# EAGLE design STM32 RX (EAGLE 9.5.0)
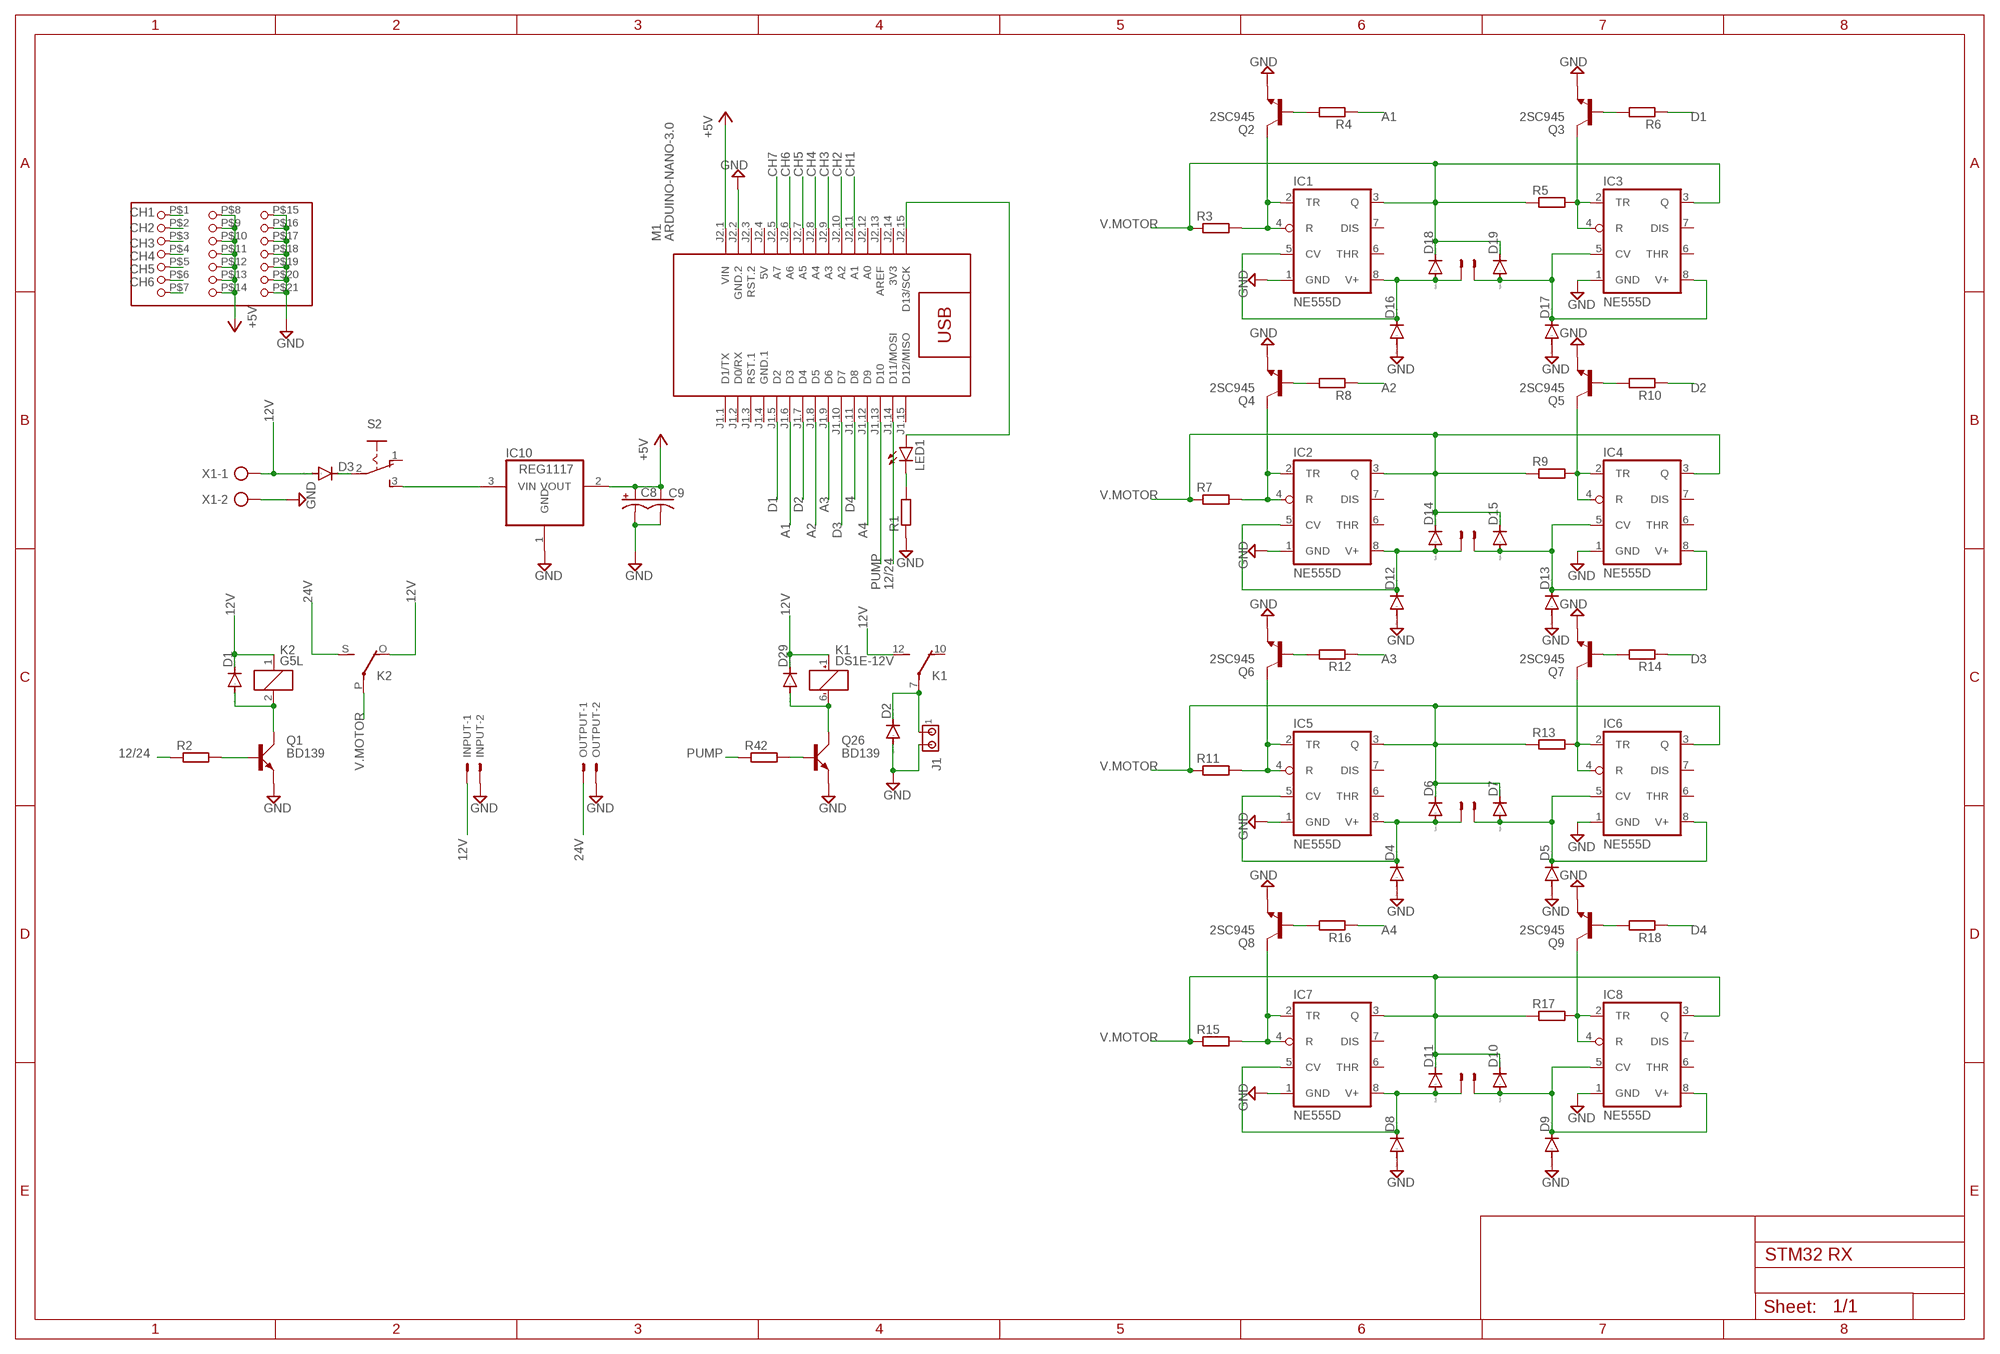
[diagram p0: schematic, sheet 1]

## Parts
C8  CPOL-USE2.5-6  [E2,5-6]
C9  C-US050-025X075  [C050-025X075]
D1  1N4933  [DO41-10]
D2  1N4933  [DO41-10]
D3  1N4933  [DO41-10]
D4  1N4933  [DO41-10]
D5  1N4933  [DO41-10]
D6  1N4933  [DO41-10]
D7  1N4933  [DO41-10]
D8  1N4933  [DO41-10]
D9  1N4933  [DO41-10]
D10  1N4933  [DO41-10]
D11  1N4933  [DO41-10]
D12  1N4933  [DO41-10]
D13  1N4933  [DO41-10]
D14  1N4933  [DO41-10]
D15  1N4933  [DO41-10]
D16  1N4933  [DO41-10]
D17  1N4933  [DO41-10]
D18  1N4933  [DO41-10]
D19  1N4933  [DO41-10]
D29  1N4933  [DO41-10]
IC1  NE555D  [SO08]
IC2  NE555D  [SO08]
IC3  NE555D  [SO08]
IC4  NE555D  [SO08]
IC5  NE555D  [SO08]
IC6  NE555D  [SO08]
IC7  NE555D  [SO08]
IC8  NE555D  [SO08]
IC10  REG1117  [SOT223]
INPUT  22-23-2021  [22-23-2021]
J1  MTA02-156  [1X2MTA]
K1  DS1E-12V  [DS1E]
K2  G5L  [G5LE]
LED1  LED5MM  [LED5MM]
M1  ARDUINO-NANO-3.0  [ARDUINO-NANO-3.0]
OUTPUT  22-23-2021  [22-23-2021]
OUTPUT1  22-23-2021  [22-23-2021]
OUTPUT2  22-23-2021  [22-23-2021]
OUTPUT3  22-23-2021  [22-23-2021]
OUTPUT4  22-23-2021  [22-23-2021]
Q1  BD139  [TO126AV]
Q2  2SC945  [TO92-ECB]
Q3  2SC945  [TO92-ECB]
Q4  2SC945  [TO92-ECB]
Q5  2SC945  [TO92-ECB]
Q6  2SC945  [TO92-ECB]
Q7  2SC945  [TO92-ECB]
Q8  2SC945  [TO92-ECB]
Q9  2SC945  [TO92-ECB]
Q26  BD139  [TO126AV]
R1  R-EU_0207/10  [0207/10]
R2  R-EU_0207/10  [0207/10]
R3  R-EU_0207/10  [0207/10]
R4  R-EU_0207/10  [0207/10]
R5  R-EU_0207/10  [0207/10]
R6  R-EU_0207/10  [0207/10]
R7  R-EU_0207/10  [0207/10]
R8  R-EU_0207/10  [0207/10]
R9  R-EU_0207/10  [0207/10]
R10  R-EU_0207/10  [0207/10]
R11  R-EU_0207/10  [0207/10]
R12  R-EU_0207/10  [0207/10]
R13  R-EU_0207/10  [0207/10]
R14  R-EU_0207/10  [0207/10]
R15  R-EU_0207/10  [0207/10]
R16  R-EU_0207/10  [0207/10]
R17  R-EU_0207/10  [0207/10]
R18  R-EU_0207/10  [0207/10]
R42  R-EU_0207/10  [0207/10]
S2  255SB  [255SB]
U$1  PINHEAD3  [PINHEAD3]
X1  AK500/2  [AK500/2]

## Nets
12/24: M1.J1.14(D11/MOSI) R2.1
12V: D1.C D3.A D29.C INPUT.1 K1.1(1:+) K1.12(2:S) K2.1 K2.O(2:O) X1.1
24V: K2.S(2:S) OUTPUT.1
+5V: C8.+ C9.1 IC10.2(VOUT) M1.J2.1(VIN) U$1.P$8 U$1.P$9 U$1.P$10 U$1.P$11 U$1.P$12 U$1.P$13 U$1.P$14
A1: M1.J1.6(D3) R4.1
A2: M1.J1.8(D5) R8.1
A3: M1.J1.9(D6) R12.1
A4: M1.J1.12(D9) R16.1
CH1: M1.J2.11(A1) U$1.P$1
CH2: M1.J2.10(A2) U$1.P$2
CH3: M1.J2.9(A3) U$1.P$3
CH4: M1.J2.8(A4) U$1.P$4
CH5: M1.J2.7(A5) U$1.P$5
CH6: M1.J2.6(A6) U$1.P$6
CH7: M1.J2.5(A7)
D1: M1.J1.5(D2) R6.1
D2: M1.J1.7(D4) R10.1
D3: M1.J1.10(D7) R14.1
D4: M1.J1.11(D8) R18.1
GND: C8.- C9.2 D2.A D4.A D5.A D8.A D9.A D12.A D13.A D16.A D17.A IC1.1(GND) IC2.1(GND) IC3.1(GND) IC4.1(GND) IC5.1(GND) IC6.1(GND) IC7.1(GND) IC8.1(GND) IC10.1(GND) INPUT.2 J1.2 M1.J2.2(GND.2) OUTPUT.2 Q1.E Q2.E Q3.E Q4.E Q5.E Q6.E Q7.E Q8.E Q9.E Q26.E R1.1 U$1.P$15 U$1.P$16 U$1.P$17 U$1.P$18 U$1.P$19 U$1.P$20 U$1.P$21 X1.2
N$1: LED1.A M1.J2.15(D13/SCK)
N$2: D1.A K2.2 Q1.C
N$3: LED1.K(C) R1.2
N$4: Q1.B R2.2
N$5: D3.C S2.2(P)
N$6: IC10.3(VIN) S2.3(S)
N$13: IC1.2(TR) IC1.4(R) Q2.C R3.2
N$14: D16.C D18.A IC1.5(CV) IC1.8(V+) OUTPUT1.1
N$15: IC2.2(TR) IC2.4(R) Q4.C R7.2
N$16: Q2.B R4.2
N$17: IC3.2(TR) IC3.4(R) Q3.C R5.2
N$18: D17.C D19.A IC3.5(CV) IC3.8(V+) OUTPUT1.2
N$19: Q3.B R6.2
N$20: D12.C D14.A IC2.5(CV) IC2.8(V+) OUTPUT2.1
N$21: Q4.B R8.2
N$22: IC4.2(TR) IC4.4(R) Q5.C R9.2
N$23: D13.C D15.A IC4.5(CV) IC4.8(V+) OUTPUT2.2
N$24: Q5.B R10.2
N$25: IC5.2(TR) IC5.4(R) Q6.C R11.2
N$26: D4.C D6.A IC5.5(CV) IC5.8(V+) OUTPUT3.1
N$27: Q6.B R12.2
N$28: IC6.2(TR) IC6.4(R) Q7.C R13.2
N$29: D5.C D7.A IC6.5(CV) IC6.8(V+) OUTPUT3.2
N$30: Q7.B R14.2
N$31: IC7.2(TR) IC7.4(R) Q8.C R15.2
N$32: D8.C D11.A IC7.5(CV) IC7.8(V+) OUTPUT4.1
N$33: Q8.B R16.2
N$34: IC8.2(TR) IC8.4(R) Q9.C R17.2
N$35: D9.C D10.A IC8.5(CV) IC8.8(V+) OUTPUT4.2
N$36: Q9.B R18.2
N$38: U$1.P$7
N$62: D2.C J1.1 K1.7(2:P)
N$63: D29.A K1.6(1:-) Q26.C
N$64: Q26.B R42.2
PUMP: M1.J1.13(D10) R42.1
V.MOTOR: D6.C D7.C D10.C D11.C D14.C D15.C D18.C D19.C IC1.3(Q) IC2.3(Q) IC3.3(Q) IC4.3(Q) IC5.3(Q) IC6.3(Q) IC7.3(Q) IC8.3(Q) K2.P(2:P) R3.1 R5.1 R7.1 R9.1 R11.1 R13.1 R15.1 R17.1
Unconnected: IC1.6(THR) IC1.7(DIS) IC2.6(THR) IC2.7(DIS) IC3.6(THR) IC3.7(DIS) IC4.6(THR) IC4.7(DIS) IC5.6(THR) IC5.7(DIS) IC6.6(THR) IC6.7(DIS) IC7.6(THR) IC7.7(DIS) IC8.6(THR) IC8.7(DIS) K1.10(2:O) M1.J1.1(D1/TX) M1.J1.2(D0/RX) M1.J1.3(RST.1) M1.J1.15(D12/MISO) M1.J2.3(RST.2) M1.J2.12(A0) M1.J2.13(AREF) S2.1(O)

## Power pins joined to a net without a drawn wire
3V3: M1.J2.14(3V3)
5V: M1.J2.4(5V)
GND.1: M1.J1.4(GND.1)

## Library data of the parts
C8 = rcl:CPOL-US: POLARIZED CAPACITOR, American symbol; SPICEPREFIX: C
C9 = rcl:C-US: CAPACITOR, American symbol; SPICEPREFIX: C
D1-D19 D29 = diode:1N4933: DIODE fast recovery rectifier, 1A
IC1-IC8 = linear:*555: TIMER
IC10 = burr-brown:REG1117: 800mA and 1A Low Dropout (LDO) Positive Regulator 1.8V, 2.5V, 2.85V, 3.3V, 5V, and Adj; MPN: REG1117; OC_FARNELL: 1097566; OC_NEWARK: 14P6981
INPUT OUTPUT OUTPUT1-OUTPUT4 = con-molex:22-23-2021: .100" (2.54mm) Center Header - 2 Pin; MF: MOLEX; MPN: 22-23-2021; OC_FARNELL: 1462926; OC_NEWARK: 25C3832
J1 = con-amp:MTA02-156: AMP connector
K1 = relay:DS1E-*?: DS-RELAYS HIGHLY SENSITIVE 1500 V FCC SURGE NAiS WITHSTANDING MINIATURE RELAY Source: http://www.mew-europe.com/.. en_ds_61005_0001.pdf; OC_FARNELL: unknown; OC_NEWARK: unknown
K2 = relay:G5L: RELAY 1 x switch, 10 A/120 V AC, 8 A/30 V ADC, Omron; OC_FARNELL: unknown; OC_NEWARK: unknown
LED1 = led:LED: LED OSRAM: - CHIPLED LG R971, LG N971, LY N971, LG Q971, LY Q971, LO R971, LY R971 LH N974, LH R974 LS Q976, LO Q976, LY Q976 LO Q996 - Hyper CHIPLED LW Q18S LB Q993, LB Q99A, LB R99A - SideLED LS A670, LO A670, LY A670, LG A670, LP A670 LB A673, LV A673, LT A673, LW A673 LH A674 LY A675 LS A676, LA A676, LO A676, LY A676, LW A676 LS A679, LY A679, LG A679 - Hyper Micro SIDELED® LS Y876, LA Y876, LO Y876, LY Y876 LT Y87S - SmartLED LW L88C, LW L88S LB L89C, LB L89S, LG L890 LS L89K, LO L89K, LY L89K LS L896, LA L896, LO L896, LY L896 - TOPLED LS T670, LO T670, LY T670, LG T670, LP T670 LSG T670, LSP T670, LSY T670, LOP T670, LYG T670 LG T671, LOG T671, LSG T671 LB T673, LV T673, LT T673, LW T673 LH T674 LS T676, LA T676, LO T676, LY T676, LB T676, LH T676, LSB T676, LW T676 LB T67C, LV T67C, LT T67C, LS T67K, LO T67K, LY T67K, LW E67C LS E67B, LA E67B, LO E67B, LY E67B, LB E67C, LV E67C, LT E67C LW T67C LS T679, LY T679, LG T679 LS T770, LO T770, LY T770, LG T770, LP T770 LB T773, LV T773, LT T773, LW T773 LH T774 LS E675, LA E675, LY E675, LS T675 LS T776, LA T776, LO T776, LY T776, LB T776 LHGB T686 LT T68C, LB T68C - Hyper Mini TOPLED® LB M676 - Mini TOPLED Santana® LG M470 LS M47K, LO M47K, LY M47K Source: http://www.osram.convergy.de LUXEON: - LUMILED® LXK2-PW12-R00, LXK2-PW12-S00, LXK2-PW14-U00, LXK2-PW14-V00 LXK2-PM12-R00, LXK2-PM12-S00, LXK2-PM14-U00 LXK2-PE12-Q00, LXK2-PE12-R00, LXK2-PE12-S00, LXK2-PE14-T00, LXK2-PE14-U00 LXK2-PB12-K00, LXK2-PB12-L00, LXK2-PB12-M00, LXK2-PB14-N00, LXK2-PB14-P00, LXK2-PB14-Q00 LXK2-PR12-L00, LXK2-PR12-M00, LXK2-PR14-Q00, LXK2-PR14-R00 LXK2-PD12-Q00, LXK2-PD12-R00, LXK2-PD12-S00 LXK2-PH12-R00, LXK2-PH12-S00 LXK2-PL12-P00, LXK2-PL12-Q00, LXK2-PL12-R00 Source: www.luxeon.com KINGBRIGHT: KA-3528ASYC Source: www.kingbright.com
M1 = diy-modules:ARDUINO-NANO-3.0: Arduino Nano 3.0 and compatible devices More details available here: https://www.arduino.cc/en/Main/ArduinoBoardNano Click here to find device on ebay.com <http://www.ebay.com/sch/arduino+nano>
Q1 Q26 = transistor-power:BD139: NPN TRANSISTOR
Q2-Q9 = transistor:2SC945: NPN Silicon Epitaxial Planar Transistor Source: SEMTECH ELECTRONICS LTD. ... 2SC945 2.pdf
R1-R18 R42 = rcl:R-EU_: RESISTOR, European symbol; SPICEPREFIX: R
S2 = switch:255SB: SLIDING SWITCH Distributor Buerklin, 11G810
U$1 = pinhead3:PINHEAD3
X1 = con-ptr500:AK500/2: CONNECTOR; OC_FARNELL: unknown; OC_NEWARK: unknown

## Board
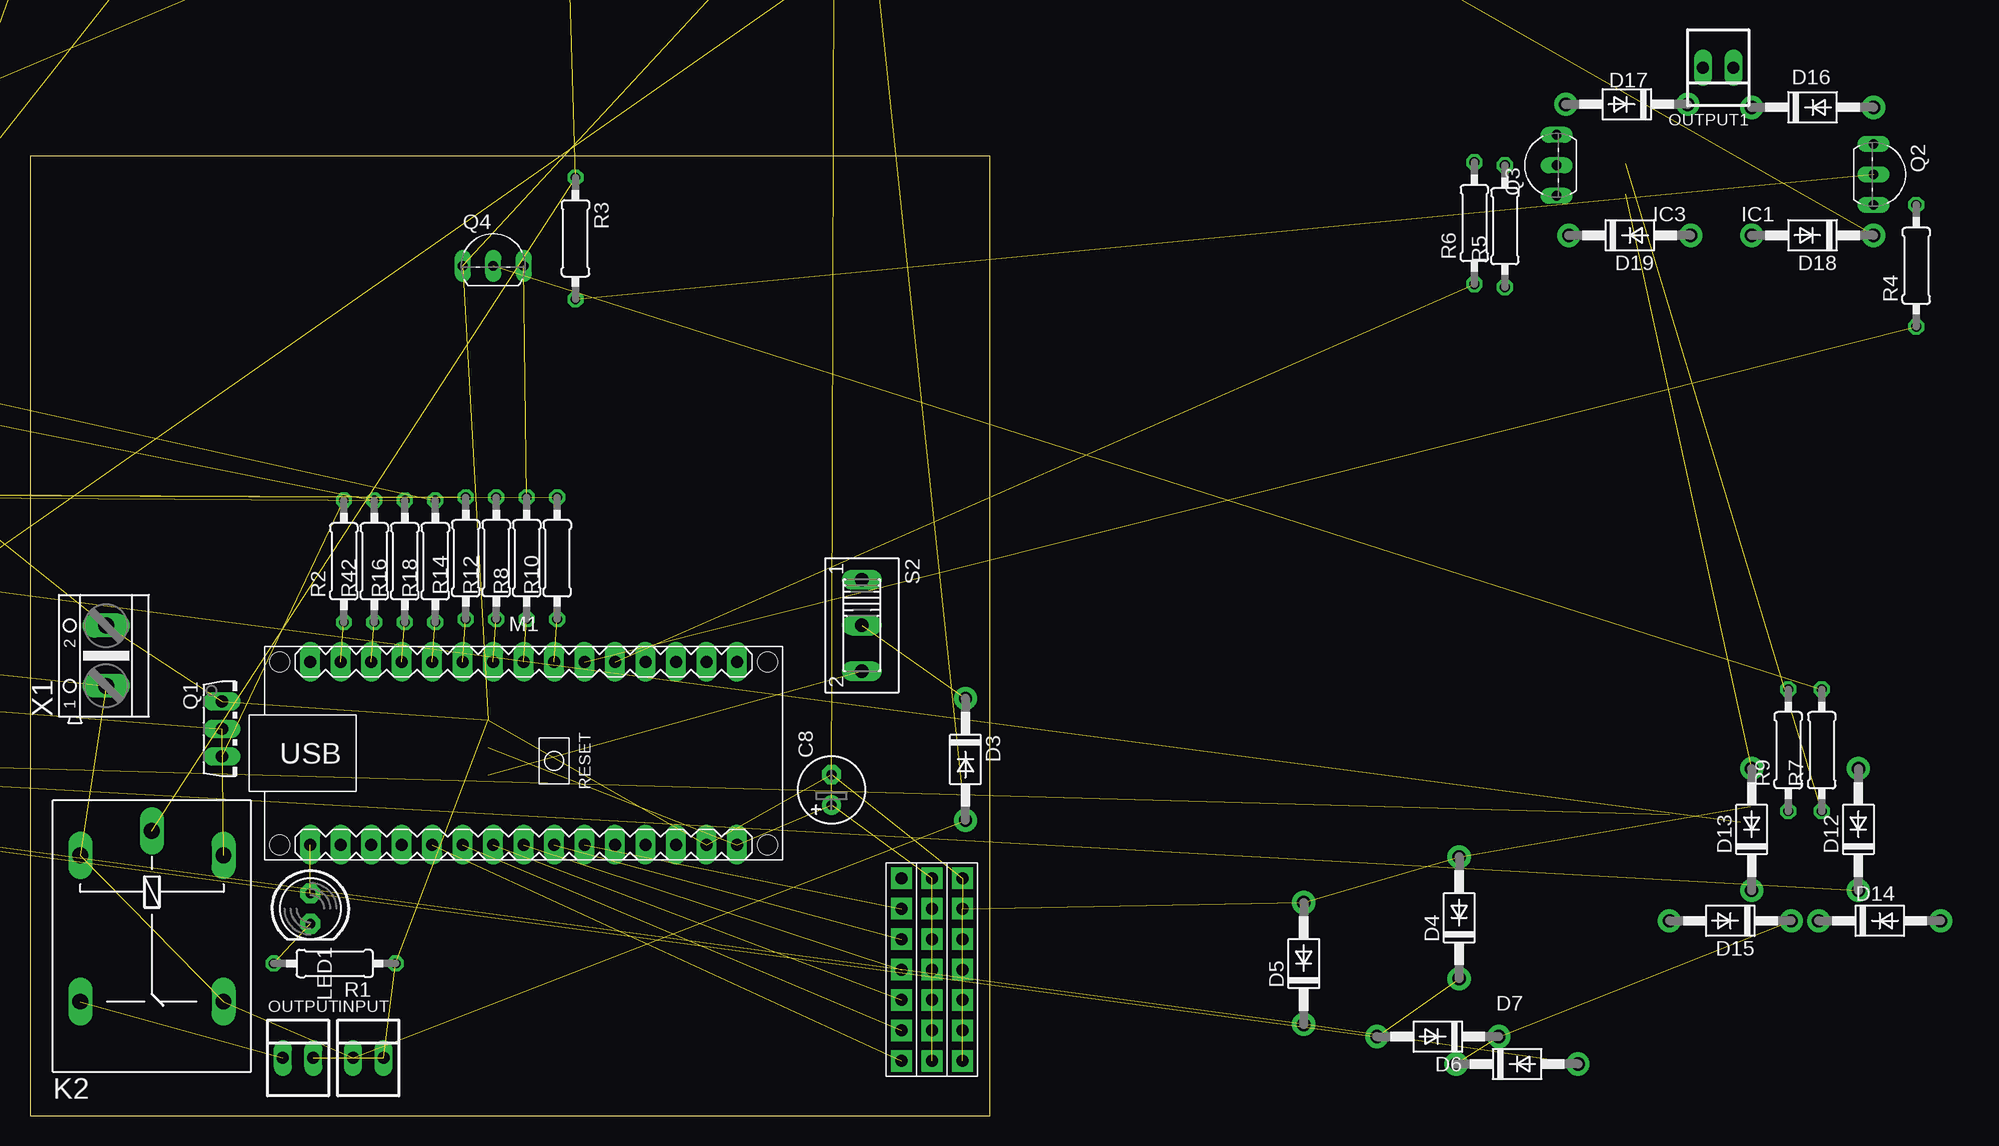
[diagram p1: board, top side]
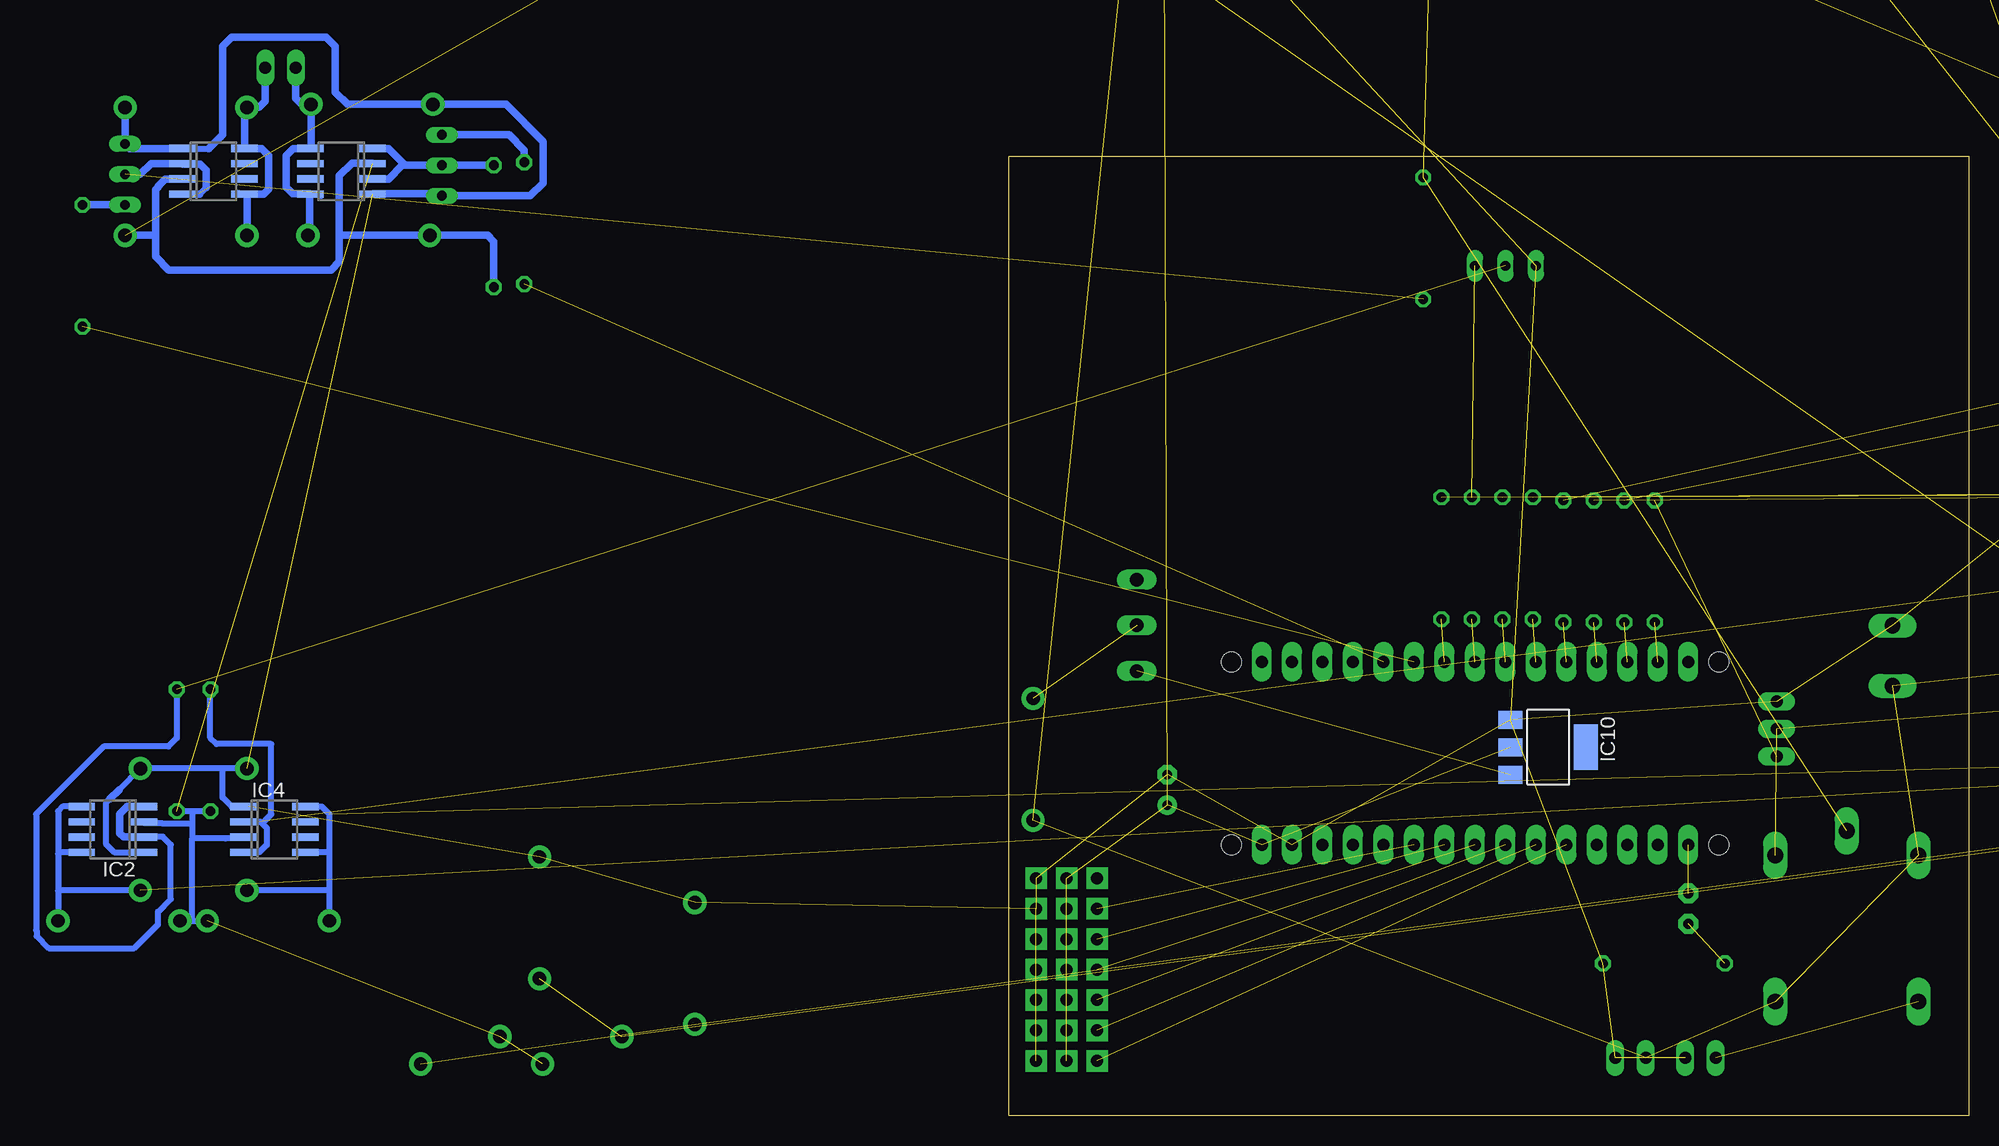
[diagram p2: board, bottom side, seen from below]

Size 80 x 80 mm. Coordinates in mm from the lower left corner, seen from the top.
Outline: 0,0 80,0 80,80 0,80 0,0
Copper layers (1*16): Top 0.035mm / dielectric 1.5mm / Bottom 0.035mm
Design rules "default": minimum track width 6mil, minimum drill 0.35mm, track to track 24mil, track to pad 24mil, pad to pad 24mil, via to via 24mil, smd to smd 24mil, copper to edge 40mil, drill to drill 6mil, minimum pad ring 10mil, minimum via ring 8mil, stop-mask expansion 4mil, vias tented up to drill 0mil, thermal gap 10mil

### Footprints (pad centres in the part's own frame; a part is rotated, then mirrored left to right if it is on the bottom)
E2,5-6 = drill 0.813 pad 1.6: + -1.27,0 | drill 0.813 pad 1.6 octagon: - 1.27,0
C050-025X075 = drill 0.813 pad 1.93 octagon: 1 -2.54,0; 2 2.54,0
DO41-10 = drill 1.118 pad 1.93: A 5.08,0; C -5.08,0
SO08 = smd 0.6 x 2.2: 1 -1.905,-2.6; 2 -0.635,-2.6; 3 0.635,-2.6; 4 1.905,-2.6; 5 1.905,2.6; 6 0.635,2.6; 7 -0.635,2.6; 8 -1.905,2.6
SOT223 = smd 1.499 x 2.007: 1 -2.261,-3.15; 2 0.025,-3.15; 3 2.311,-3.15 | smd 3.81 x 2.007: 4 0,3.15
22-23-2021 = drill 1 long: 1 -1.27,0; 2 1.27,0
1X2MTA = drill 1.676 long: 1 1.981,0; 2 -1.981,0
DS1E = drill 0.9: 1 -6.35,-3.81; 6 6.35,-3.81; 7 6.35,3.81; 10 -1.27,3.81; 12 -6.35,3.81
G5LE = drill 1.321 long: 1 -7.493,-5.969; 2 -7.493,5.969; O 4.699,5.969; P -9.525,0; S 4.699,-5.969
LED5MM = drill 0.813 pad 1.676 octagon: A -1.27,0; K 1.27,0
ARDUINO-NANO-3.0 = drill 1 pad 1.676 long: J1.1 17.78,7.62; J1.2 15.24,7.62; J1.3 12.7,7.62; J1.4 10.16,7.62; J1.5 7.62,7.62; J1.6 5.08,7.62; J1.7 2.54,7.62; J1.8 0,7.62; J1.9 -2.54,7.62; J1.10 -5.08,7.62; J1.11 -7.62,7.62; J1.12 -10.16,7.62; J1.13 -12.7,7.62; J1.14 -15.24,7.62; J1.15 -17.78,7.62; J2.1 17.78,-7.62; J2.2 15.24,-7.62; J2.3 12.7,-7.62; J2.4 10.16,-7.62; J2.5 7.62,-7.62; J2.6 5.08,-7.62; J2.7 2.54,-7.62; J2.8 0,-7.62; J2.9 -2.54,-7.62; J2.10 -5.08,-7.62; J2.11 -7.62,-7.62; J2.12 -10.16,-7.62; J2.13 -12.7,-7.62; J2.14 -15.24,-7.62; J2.15 -17.78,-7.62 | hole 1.651: -20.32,7.62; -20.32,-7.62; 20.32,-7.62; 20.32,7.62
TO126AV = drill 1.016 long: B 2.286,-1.27; C 0,-1.27; E -2.286,-1.27
TO92-ECB = drill 0.813 long: B 2.54,0; C 0,0; E -2.54,0
0207/10 = drill 0.813 octagon: 1 -5.08,0; 2 5.08,0
255SB = drill 1.118 long: 1 -3.81,0; 2 0,0; 3 3.81,0
PINHEAD3 = drill 1 pad 1.778 square: P$1 -7.62,2.54; P$2 -5.08,2.54; P$3 -2.54,2.54; P$4 0,2.54; P$5 2.54,2.54; P$6 5.08,2.54; P$7 7.62,2.54; P$8 -7.62,0; P$9 -5.08,0; P$10 -2.54,0; P$11 0,0; P$12 2.54,0; P$13 5.08,0; P$14 7.62,0; P$15 -7.62,-2.54; P$16 -5.08,-2.54; P$17 -2.54,-2.54; P$18 0,-2.54; P$19 2.54,-2.54; P$20 5.08,-2.54; P$21 7.62,-2.54
AK500/2 = drill 1.321 long: 1 -2.515,0; 2 2.515,0

### Placement (x,y rotation side)
C8  66.8,27.18 90 top
C9  69.6,109.98 0 top  (outside the outline)
D1  -32.77,41.15 270 top  (outside the outline)
D2  -22.35,50.04 180 top  (outside the outline)
D3  77.98,29.72 270 top
D4  119.13,16.51 90 top  (outside the outline)
D5  106.17,12.7 90 top  (outside the outline)
D6  117.35,6.6 180 top  (outside the outline)
D7  123.95,4.32 0 top  (outside the outline)
D8  -57.15,71.12 0 top  (outside the outline)
D9  -69.85,71.12 0 top  (outside the outline)
D10  -82.55,71.12 0 top  (outside the outline)
D11  -95.25,71.12 0 top  (outside the outline)
D12  152.4,23.88 90 top  (outside the outline)
D13  143.51,23.88 90 top  (outside the outline)
D14  154.18,16.26 0 top  (outside the outline)
D15  141.73,16.26 180 top  (outside the outline)
D16  148.59,84.07 0 top  (outside the outline)
D17  133.1,84.33 180 top  (outside the outline)
D18  148.59,73.41 180 top  (outside the outline)
D19  133.35,73.41 0 top  (outside the outline)
D29  74.68,104.9 0 top  (outside the outline)
IC1  146.3,78.74 270 bottom  (outside the outline)
IC2  154.69,23.88 90 bottom  (outside the outline)
IC3  135.64,78.74 90 bottom  (outside the outline)
IC4  141.22,23.88 270 bottom  (outside the outline)
IC5  -148.08,49.53 0 bottom  (outside the outline)
IC6  -160.27,-6.1 0 bottom  (outside the outline)
IC7  -141.48,50.55 0 bottom  (outside the outline)
IC8  -148.84,-6.1 0 bottom  (outside the outline)
IC10  35.05,30.73 270 bottom
INPUT  28.19,4.83 0 top
J1  11.68,136.14 0 top  (outside the outline)
K1  -20.32,43.18 0 top  (outside the outline)
K2  10.16,14.22 270 top
LED1  23.37,17.27 270 top
M1  41.15,30.23 0 top
OUTPUT  22.35,4.83 0 top
OUTPUT1  140.72,87.38 180 top  (outside the outline)
OUTPUT2  -54.61,30.48 0 top  (outside the outline)
OUTPUT3  -63.5,30.48 0 top  (outside the outline)
OUTPUT4  -72.39,30.48 0 top  (outside the outline)
Q1  17.27,32.26 270 top
Q2  153.67,78.49 270 top  (outside the outline)
Q3  127.25,79.25 90 top  (outside the outline)
Q4  38.61,70.87 0 top
Q5  -66.04,52.07 0 top  (outside the outline)
Q6  -74.93,52.07 0 top  (outside the outline)
Q7  -83.82,52.07 0 top  (outside the outline)
Q8  -92.71,52.07 0 top  (outside the outline)
Q9  -17.78,62.23 0 top  (outside the outline)
Q26  -34.29,64.77 0 top  (outside the outline)
R1  25.4,12.7 180 top
R2  26.16,46.23 90 top
R3  45.47,73.15 270 top
R4  157.23,70.87 90 top  (outside the outline)
R5  122.94,74.17 90 top  (outside the outline)
R6  120.4,74.42 90 top  (outside the outline)
R7  149.35,30.48 90 top  (outside the outline)
R8  41.4,46.48 90 top
R9  146.56,30.48 90 top  (outside the outline)
R10  43.94,46.48 90 top
R11  11.18,116.33 0 top  (outside the outline)
R12  38.86,46.48 90 top
R13  74.68,121.41 0 top  (outside the outline)
R14  36.32,46.48 90 top
R15  49.28,121.41 0 top  (outside the outline)
R16  31.24,46.23 90 top
R17  23.88,121.41 0 top  (outside the outline)
R18  33.78,46.23 90 top
R42  28.7,46.23 90 top
S2  69.34,40.89 270 top
U$1  75.18,12.19 90 top
X1  6.35,38.35 90 top

### Tracks (layer width: path | path; a pad name or v marks a point on that pad's centre or on a via)
12/24  (1 unrouted)
12V  (8 unrouted)
24V  (1 unrouted)
+5V  (10 unrouted)
A1  (1 unrouted)
A2  (1 unrouted)
A3  (1 unrouted)
A4  (1 unrouted)
CH1  (1 unrouted)
CH2  (1 unrouted)
CH3  (1 unrouted)
CH4  (1 unrouted)
CH5  (1 unrouted)
CH6  (1 unrouted)
D1  (1 unrouted)
D2  (1 unrouted)
D3  (1 unrouted)
D4  (1 unrouted)
GND  (34 unrouted)
  Bottom 0.254: 130.56,84.33 128.52,84.33
  Bottom 0.508: IC1.1 146.69,80.64 | IC2.1 154.56,21.97 155.27,22.68 155.27,26.09 154.94,26.42 | 143.38,25.78 IC4.1 144.78,25.78 145.54,26.54 145.54,28.96 | D13.A 145.54,28.96 | 145.54,28.96 D12.A 154.18,27.18
  Bottom 0.61: IC1.1 153.29,80.64 Q2.E D16.A | IC3.1 132.98,76.89 127.44,76.89 Q3.E 119.89,76.71 118.82,77.78 118.82,81.23 121.92,84.33 D17.A 128.52,84.33 135.13,84.33 136.14,85.34 136.14,89.15 136.91,89.92 144.78,89.92 145.54,89.15 145.54,81.79 146.69,80.64 | IC4.1 144.4,25.78 | 154.18,27.18 154.94,26.42
N$1  (1 unrouted)
N$2  (2 unrouted)
N$3  (1 unrouted)
N$4  (1 unrouted)
N$5  (1 unrouted)
N$6  (1 unrouted)
N$13  (1 unrouted)
  Bottom 0.508: 146.89,77.39 147.45,76.83
  Bottom 0.61: Q2.C 152.4,78.49 151.51,79.38 IC1.2 148.85,79.32 148.4,79.32 148.39,79.32 147.39,79.32 146.89,78.82 146.89,77.39 | 147.45,76.83 IC1.4
N$14
  Bottom 0.61: IC1.5 142.11,76.83 141.69,77.26 141.69,80.05 142.28,80.64 IC1.8 143.7,83.88 D16.C 142.49,84.07 141.99,84.58 OUTPUT1.1 | IC1.5 144.15,76.83 144.2,76.89 | 144.27,76.89 144.22,76.83 IC1.5 | D18.A 143.51,76.64 IC1.5
N$15  (1 unrouted)
  Bottom 0.508: R7.2 149.35,31.5 150.06,30.79 155.45,30.79 161.09,25.15 161.09,15.5 161.04,15.45 161.04,14.99 160.02,13.97 152.91,13.97 150.93,15.95 150.93,17.01 149.86,18.08 149.86,22.61 150.52,23.27 151.07,23.27 151.1,23.29 151.54,23.29 151.55,23.29 152.04,23.29 IC2.2
  Bottom 0.61: IC2.4 153.51,25.78 154.1,25.19 154.1,23.54 153.8,23.24 IC2.2
N$16
  Bottom 0.61: R4.2 Q2.B
N$17
  Bottom 0.61: IC3.4 131.7,80.64 130.43,79.38 130.56,79.25 | 130.56,79.25 Q3.C R5.2 | IC3.2 131.7,78.11 130.56,79.25
N$18
  Bottom 0.61: 137.41,76.71 137.54,76.83 IC3.8 138.29,76.89 | 138.29,76.89 139.72,76.89 140.25,77.43 140.25,80.05 139.66,80.64 IC3.5 138.18,80.7 D17.C 138.94,84.33 139.45,84.84 OUTPUT1.2 | D19.A 138.29,73.54 138.29,76.89
N$19
  Bottom 0.61: Q3.B 121.67,81.79 120.4,80.52 R6.2
N$20  (1 unrouted)
  Bottom 0.508: IC2.5 158.88,25.78 159.26,25.4 159.26,21.84 | 159.26,21.84 159.26,18.8 | 159.26,18.8 D14.A | IC2.8 159.13,21.97 159.26,21.84 | D12.C 159.26,18.8
N$21  (1 unrouted)
N$22  (1 unrouted)
  Bottom 0.508: IC4.4 142.47,21.97 141.86,22.58 141.86,24 142.24,24.38 | 142.24,24.38 142.37,24.51 IC4.2 142.56,24.51 | R9.2 146.56,31.5 146.05,30.99 141.48,30.99 141.48,25.15 142.24,24.38
N$23  (1 unrouted)
  Bottom 0.508: 136.66,25.17 136.66,25.15 136.65,25.15 | IC4.8 137.27,25.78 136.66,25.17 | 136.66,25.17 136.65,25.16 136.65,21.84 | 136.65,21.84 136.65,18.8 | 136.65,18.8 D15.A | 136.65,21.84 136.78,21.97 IC4.5 | 136.65,18.8 D13.C
N$24  (1 unrouted)
N$25  (3 unrouted)
N$26  (4 unrouted)
N$27  (1 unrouted)
N$28  (3 unrouted)
N$29  (4 unrouted)
N$30  (1 unrouted)
N$31  (3 unrouted)
N$32  (4 unrouted)
N$33  (1 unrouted)
N$34  (3 unrouted)
N$35  (4 unrouted)
N$36  (1 unrouted)
N$62  (2 unrouted)
N$63  (2 unrouted)
N$64  (1 unrouted)
PUMP  (1 unrouted)
V.MOTOR  (15 unrouted)
  Bottom 0.508: R9.1 148.08,25.4 | 148.08,25.4 R7.1 | 148.08,25.4 148.08,24.38 | 148.08,24.38 148.08,23.11 | IC4.3 143.93,23.14 145.28,23.14 145.3,23.11 148.08,23.11 | IC2.3 151.98,24.41 150.63,24.41 150.61,24.38 148.08,24.38 | 148.08,23.11 148.08,16.26 D14.C D15.C
  Bottom 0.61: IC3.3 133.09,79.43 134.75,79.43 135.82,78.36 135.82,73.41 | IC1.3 150.33,78.11 150.92,77.51 150.92,77.43 151.13,77.22 151.13,73.41 | 135.82,73.41 135.82,71.19 136.5,70.51 150.01,70.51 151.13,71.63 151.13,73.41 | D18.C 151.13,73.41 | 135.82,73.41 D19.C 123.44,73.41 122.94,72.9 R5.1 | IC2.3 152.03,24.45